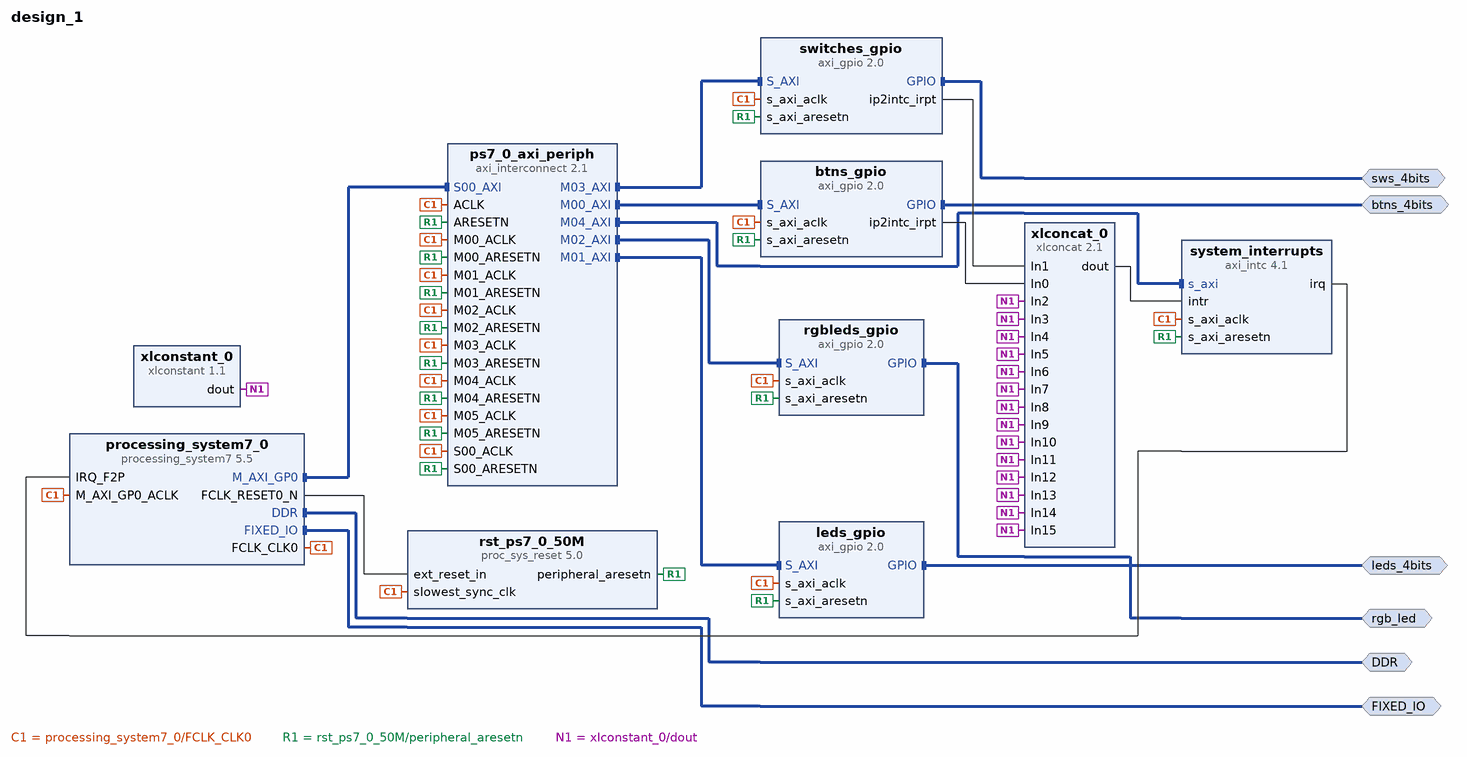
[diagram p0: block diagram of the top level]
# Vivado block design design_1, xc7z010clg400-1, Vivado 2023.1.1
create_bd_design design_1

create_bd_intf_port -mode Master -vlnv xilinx.com:interface:ddrx_rtl:1.0 DDR
create_bd_intf_port -mode Master -vlnv xilinx.com:display_processing_system7:fixedio_rtl:1.0 FIXED_IO
create_bd_intf_port -mode Master -vlnv xilinx.com:interface:gpio_rtl:1.0 btns_4bits
create_bd_intf_port -mode Master -vlnv xilinx.com:interface:gpio_rtl:1.0 leds_4bits
create_bd_intf_port -mode Master -vlnv xilinx.com:interface:gpio_rtl:1.0 rgb_led
create_bd_intf_port -mode Master -vlnv xilinx.com:interface:gpio_rtl:1.0 sws_4bits

create_bd_cell -type ip -vlnv xilinx.com:ip:processing_system7:5.5 processing_system7_0
set_property -dict [list \
  CONFIG.PCW_APU_PERIPHERAL_FREQMHZ 667 \
  CONFIG.PCW_ENET0_ENET0_IO {MIO 16 .. 27} \
  CONFIG.PCW_ENET0_GRP_MDIO_ENABLE 1 \
  CONFIG.PCW_ENET0_GRP_MDIO_IO {MIO 52 .. 53} \
  CONFIG.PCW_ENET0_PERIPHERAL_ENABLE 1 \
  CONFIG.PCW_ENET0_RESET_ENABLE 0 \
  CONFIG.PCW_ENET_RESET_ENABLE 1 \
  CONFIG.PCW_ENET_RESET_SELECT {Share reset pin} \
  CONFIG.PCW_GPIO_MIO_GPIO_ENABLE 1 \
  CONFIG.PCW_GPIO_MIO_GPIO_IO MIO \
  CONFIG.PCW_I2C_RESET_ENABLE 0 \
  CONFIG.PCW_IRQ_F2P_INTR 1 \
  CONFIG.PCW_PRESET_BANK1_VOLTAGE {LVCMOS 1.8V} \
  CONFIG.PCW_QSPI_GRP_FBCLK_ENABLE 1 \
  CONFIG.PCW_QSPI_GRP_FBCLK_IO {MIO 8} \
  CONFIG.PCW_QSPI_GRP_SINGLE_SS_ENABLE 1 \
  CONFIG.PCW_QSPI_GRP_SINGLE_SS_IO {MIO 1 .. 6} \
  CONFIG.PCW_QSPI_PERIPHERAL_ENABLE 1 \
  CONFIG.PCW_QSPI_QSPI_IO {MIO 1 .. 6} \
  CONFIG.PCW_SD0_GRP_CD_ENABLE 1 \
  CONFIG.PCW_SD0_GRP_CD_IO {MIO 47} \
  CONFIG.PCW_SD0_GRP_WP_ENABLE 0 \
  CONFIG.PCW_SD0_PERIPHERAL_ENABLE 1 \
  CONFIG.PCW_SD0_SD0_IO {MIO 40 .. 45} \
  CONFIG.PCW_SDIO_PERIPHERAL_FREQMHZ 50 \
  CONFIG.PCW_SINGLE_QSPI_DATA_MODE x4 \
  CONFIG.PCW_UART1_PERIPHERAL_ENABLE 1 \
  CONFIG.PCW_UART1_UART1_IO {MIO 48 .. 49} \
  CONFIG.PCW_UART_PERIPHERAL_FREQMHZ 100 \
  CONFIG.PCW_UIPARAM_DDR_FREQ_MHZ 533.333333 \
  CONFIG.PCW_UIPARAM_DDR_MEMORY_TYPE {DDR 3 (Low Voltage)} \
  CONFIG.PCW_UIPARAM_DDR_PARTNO {MT41K256M16 RE-125} \
  CONFIG.PCW_USB0_PERIPHERAL_ENABLE 1 \
  CONFIG.PCW_USB0_RESET_ENABLE 1 \
  CONFIG.PCW_USB0_RESET_IO {MIO 46} \
  CONFIG.PCW_USB0_USB0_IO {MIO 28 .. 39} \
  CONFIG.PCW_USB_RESET_ENABLE 1 \
  CONFIG.PCW_USB_RESET_SELECT {Share reset pin} \
  CONFIG.PCW_USE_FABRIC_INTERRUPT 1 \
] [get_bd_cells processing_system7_0]
# 296 more settings of processing_system7_0 are not shown: defaults, MIO pin electricals, DDR timing, and values the tool derives
create_bd_cell -type ip -vlnv xilinx.com:ip:axi_gpio:2.0 leds_gpio
set_property -dict {CONFIG.GPIO_BOARD_INTERFACE leds_4bits CONFIG.USE_BOARD_FLOW true} [get_bd_cells leds_gpio]
create_bd_cell -type ip -vlnv xilinx.com:ip:axi_gpio:2.0 btns_gpio
set_property -dict [list \
  CONFIG.C_INTERRUPT_PRESENT 1 \
  CONFIG.GPIO_BOARD_INTERFACE btns_4bits \
  CONFIG.USE_BOARD_FLOW true \
] [get_bd_cells btns_gpio]
create_bd_cell -type ip -vlnv xilinx.com:ip:axi_gpio:2.0 switches_gpio
set_property -dict [list \
  CONFIG.C_INTERRUPT_PRESENT 1 \
  CONFIG.GPIO_BOARD_INTERFACE sws_4bits \
  CONFIG.USE_BOARD_FLOW true \
] [get_bd_cells switches_gpio]
create_bd_cell -type ip -vlnv xilinx.com:ip:axi_gpio:2.0 rgbleds_gpio
set_property -dict {CONFIG.GPIO_BOARD_INTERFACE rgb_led CONFIG.USE_BOARD_FLOW true} [get_bd_cells rgbleds_gpio]
create_bd_cell -type ip -vlnv xilinx.com:ip:axi_intc:4.1 system_interrupts
create_bd_cell -type ip -vlnv xilinx.com:ip:axi_interconnect:2.1 ps7_0_axi_periph
set_property -dict {CONFIG.NUM_MI 6} [get_bd_cells ps7_0_axi_periph]
create_bd_cell -type ip -vlnv xilinx.com:ip:proc_sys_reset:5.0 rst_ps7_0_50M
create_bd_cell -type ip -vlnv xilinx.com:ip:xlconcat:2.1 xlconcat_0
set_property -dict {CONFIG.NUM_PORTS 16} [get_bd_cells xlconcat_0]
create_bd_cell -type ip -vlnv xilinx.com:ip:xlconstant:1.1 xlconstant_0

# ---- connections ----

connect_bd_intf_net [get_bd_intf_ports btns_4bits] [get_bd_intf_pins btns_gpio/GPIO]
connect_bd_intf_net [get_bd_intf_ports leds_4bits] [get_bd_intf_pins leds_gpio/GPIO]
connect_bd_intf_net [get_bd_intf_ports DDR] [get_bd_intf_pins processing_system7_0/DDR]
connect_bd_intf_net [get_bd_intf_ports FIXED_IO] [get_bd_intf_pins processing_system7_0/FIXED_IO]
connect_bd_intf_net [get_bd_intf_pins processing_system7_0/M_AXI_GP0] [get_bd_intf_pins ps7_0_axi_periph/S00_AXI]
connect_bd_intf_net [get_bd_intf_pins ps7_0_axi_periph/M00_AXI] [get_bd_intf_pins btns_gpio/S_AXI]
connect_bd_intf_net [get_bd_intf_pins ps7_0_axi_periph/M01_AXI] [get_bd_intf_pins leds_gpio/S_AXI]
connect_bd_intf_net [get_bd_intf_pins ps7_0_axi_periph/M02_AXI] [get_bd_intf_pins rgbleds_gpio/S_AXI]
connect_bd_intf_net [get_bd_intf_pins ps7_0_axi_periph/M03_AXI] [get_bd_intf_pins switches_gpio/S_AXI]
connect_bd_intf_net [get_bd_intf_pins ps7_0_axi_periph/M04_AXI] [get_bd_intf_pins system_interrupts/s_axi]
connect_bd_intf_net [get_bd_intf_ports rgb_led] [get_bd_intf_pins rgbleds_gpio/GPIO]
connect_bd_intf_net [get_bd_intf_ports sws_4bits] [get_bd_intf_pins switches_gpio/GPIO]
connect_bd_net [get_bd_pins btns_gpio/ip2intc_irpt] [get_bd_pins xlconcat_0/In0]
connect_bd_net [get_bd_pins processing_system7_0/FCLK_CLK0] \
  [get_bd_pins processing_system7_0/M_AXI_GP0_ACLK] [get_bd_pins ps7_0_axi_periph/S00_ACLK] \
  [get_bd_pins rst_ps7_0_50M/slowest_sync_clk] [get_bd_pins btns_gpio/s_axi_aclk] [get_bd_pins ps7_0_axi_periph/M00_ACLK] \
  [get_bd_pins ps7_0_axi_periph/ACLK] [get_bd_pins leds_gpio/s_axi_aclk] [get_bd_pins ps7_0_axi_periph/M01_ACLK] \
  [get_bd_pins rgbleds_gpio/s_axi_aclk] [get_bd_pins ps7_0_axi_periph/M02_ACLK] [get_bd_pins switches_gpio/s_axi_aclk] \
  [get_bd_pins ps7_0_axi_periph/M03_ACLK] [get_bd_pins system_interrupts/s_axi_aclk] [get_bd_pins ps7_0_axi_periph/M04_ACLK] \
  [get_bd_pins ps7_0_axi_periph/M05_ACLK]
connect_bd_net [get_bd_pins processing_system7_0/FCLK_RESET0_N] [get_bd_pins rst_ps7_0_50M/ext_reset_in]
connect_bd_net [get_bd_pins rst_ps7_0_50M/peripheral_aresetn] \
  [get_bd_pins ps7_0_axi_periph/S00_ARESETN] [get_bd_pins btns_gpio/s_axi_aresetn] [get_bd_pins ps7_0_axi_periph/M00_ARESETN] \
  [get_bd_pins ps7_0_axi_periph/ARESETN] [get_bd_pins leds_gpio/s_axi_aresetn] [get_bd_pins ps7_0_axi_periph/M01_ARESETN] \
  [get_bd_pins rgbleds_gpio/s_axi_aresetn] [get_bd_pins ps7_0_axi_periph/M02_ARESETN] \
  [get_bd_pins switches_gpio/s_axi_aresetn] [get_bd_pins ps7_0_axi_periph/M03_ARESETN] \
  [get_bd_pins system_interrupts/s_axi_aresetn] [get_bd_pins ps7_0_axi_periph/M04_ARESETN] \
  [get_bd_pins ps7_0_axi_periph/M05_ARESETN]
connect_bd_net [get_bd_pins switches_gpio/ip2intc_irpt] [get_bd_pins xlconcat_0/In1]
connect_bd_net [get_bd_pins system_interrupts/irq] [get_bd_pins processing_system7_0/IRQ_F2P]
connect_bd_net [get_bd_pins xlconcat_0/dout] [get_bd_pins system_interrupts/intr]
connect_bd_net [get_bd_pins xlconstant_0/dout] \
  [get_bd_pins xlconcat_0/In3] [get_bd_pins xlconcat_0/In4] [get_bd_pins xlconcat_0/In6] [get_bd_pins xlconcat_0/In5] \
  [get_bd_pins xlconcat_0/In15] [get_bd_pins xlconcat_0/In14] [get_bd_pins xlconcat_0/In13] [get_bd_pins xlconcat_0/In12] \
  [get_bd_pins xlconcat_0/In11] [get_bd_pins xlconcat_0/In10] [get_bd_pins xlconcat_0/In9] [get_bd_pins xlconcat_0/In8] \
  [get_bd_pins xlconcat_0/In7] [get_bd_pins xlconcat_0/In2]

# ---- address map ----
assign_bd_address -offset 0x41200000 -range 64K -target_address_space [get_bd_addr_spaces processing_system7_0/Data] [get_bd_addr_segs btns_gpio/S_AXI/Reg]
assign_bd_address -offset 0x41210000 -range 64K -target_address_space [get_bd_addr_spaces processing_system7_0/Data] [get_bd_addr_segs leds_gpio/S_AXI/Reg]
assign_bd_address -offset 0x41220000 -range 64K -target_address_space [get_bd_addr_spaces processing_system7_0/Data] [get_bd_addr_segs rgbleds_gpio/S_AXI/Reg]
assign_bd_address -offset 0x41230000 -range 64K -target_address_space [get_bd_addr_spaces processing_system7_0/Data] [get_bd_addr_segs switches_gpio/S_AXI/Reg]
assign_bd_address -offset 0x41800000 -range 64K -target_address_space [get_bd_addr_spaces processing_system7_0/Data] [get_bd_addr_segs system_interrupts/S_AXI/Reg]

validate_bd_design
save_bd_design
